# EAGLE schematic LNA_V2 (EAGLE 7.5.0)
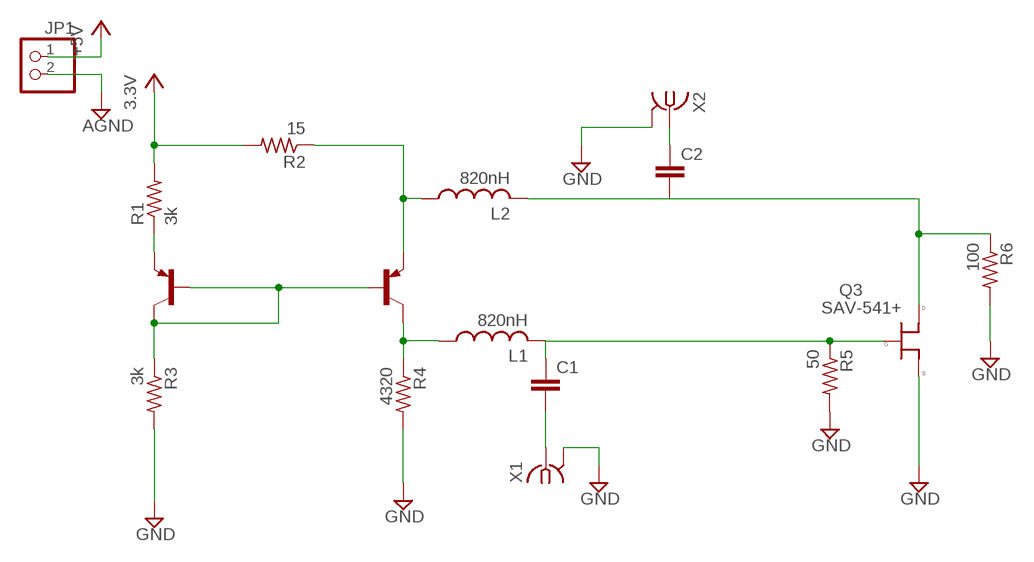
[diagram p0: schematic, sheet 1]

## Parts
C1  C-EUC0603  [C0603]
C2  C-EUC0603  [C0603]
JP1  PINHD-1X2  [1X02]
L1  820nH  L-USL3225M  [L3225M]
L2  820nH  L-USL3225M  [L3225M]
Q1  MMBT3906LT1SMD  [SOT23-BEC]
Q2  MMBT3906LT1SMD  [SOT23-BEC]
Q3  SAV-541+  [SOT-343]
R1  3k  R-US_M0805  [M0805]
R2  15  R-US_M0805  [M0805]
R3  3k  R-US_M0805  [M0805]
R4  4320  R-US_M0805  [M0805]
R5  50  R-US_M0805  [M0805]
R6  100  R-US_M0805  [M0805]
X1  SMA-142-0711-821/826  [J502-ND-142-0711-821/826]
X2  SMA-142-0711-821/826  [J502-ND-142-0711-821/826]

## Nets
+3.3V: JP1.1 R1.2 R2.2 ; supply symbol labelled +5V, 3.3V
GND: JP1.2 Q3.2(S) Q3.4(S) R3.2 R4.2 R5.2 R6.2 X1.G@1 X1.G@2 X1.G@3 X1.G@4 X2.G@1 X2.G@2 X2.G@3 X2.G@4 ; supply symbol labelled AGND
INPUT: C1.1 L1.2 Q3.3(G) R5.1
ISO_INPUT: C1.2 X1.1
ISO_OUTPUT: C2.1 X2.1
N$1: Q1.B Q1.C Q2.B R3.1
N$4: Q1.E R1.1
OUTPUT: C2.2 L2.2 Q3.1(D) R6.1
VD: L2.1 Q2.E R2.1
VG: L1.1 Q2.C R4.1

## Library data of the parts
C1 C2 = rcl:C-EU: CAPACITOR, European symbol
JP1 = pinhead:PINHD-1X2: PIN HEADER
L1 L2 = resistor:L-US: INDUCTOR, American symbol
Q1 Q2 = transistor-pnp:MMBT3906*: PNP Transistror
Q3 = ECE532_Parts:SAV-541+
R1-R6 = rcl:R-US_: RESISTOR, American symbol
X1 X2 = con-coax:SMA-: SMA 50 Ohm End Launch Jack Receptacle - Round Contact Johnson Components Source: www.johnsoncomponents.com .. J502-ND.pdf; MF: JOHNSON COMPONENTS; MPN: 142-0711-821; OC_FARNELL: 1019328; OC_NEWARK: 16F3627